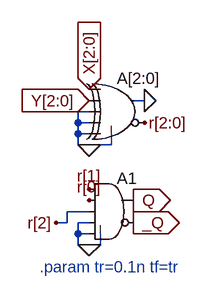
[diagram p0: schematic eq-3bit.asc]
eq-3bit.asc, the LTspice schematic file:
Version 4
SHEET 1 880 680
WIRE 176 112 160 112
WIRE 96 128 80 128
WIRE 80 144 80 128
WIRE 96 144 80 144
WIRE 80 160 80 144
WIRE 96 160 80 160
WIRE 80 176 80 160
WIRE 96 176 80 176
WIRE 128 176 128 160
WIRE 128 176 96 176
WIRE 96 272 64 272
WIRE 64 288 64 272
WIRE 64 288 48 288
WIRE 96 288 80 288
WIRE 80 304 80 288
WIRE 96 304 80 304
WIRE 80 320 80 304
WIRE 96 320 80 320
WIRE 112 320 112 304
WIRE 112 320 96 320
FLAG 96 176 0
FLAG 96 96 X[2:0]
IOPIN 96 96 In
FLAG 96 112 Y[2:0]
IOPIN 96 112 In
FLAG 176 112 0
FLAG 176 144 r[2:0]
FLAG 96 320 0
FLAG 96 240 r[1]
FLAG 96 256 r[0]
FLAG 160 256 Q
IOPIN 160 256 Out
FLAG 160 288 _Q
IOPIN 160 288 Out
FLAG 48 288 r[2]
SYMBOL Digital\\xor 144 64 R0
SYMATTR InstName A[2:0]
SYMBOL Digital\\and 128 208 R0
SYMATTR InstName A1
TEXT 24 352 Left 2 ;.param tr=0.1n tf=tr

The netlist it stands for:
* eq-3bit.asc
A[2:0] X[2:0] Y[2:0] 0 0 0 r[2:0] 0 0 XOR
A1 r[1] r[0] r[2] 0 0 _Q Q 0 AND
* .param tr=0.1n tf=tr
.backanno
.end